# EAGLE design gripper board (EAGLE 7.4.0)
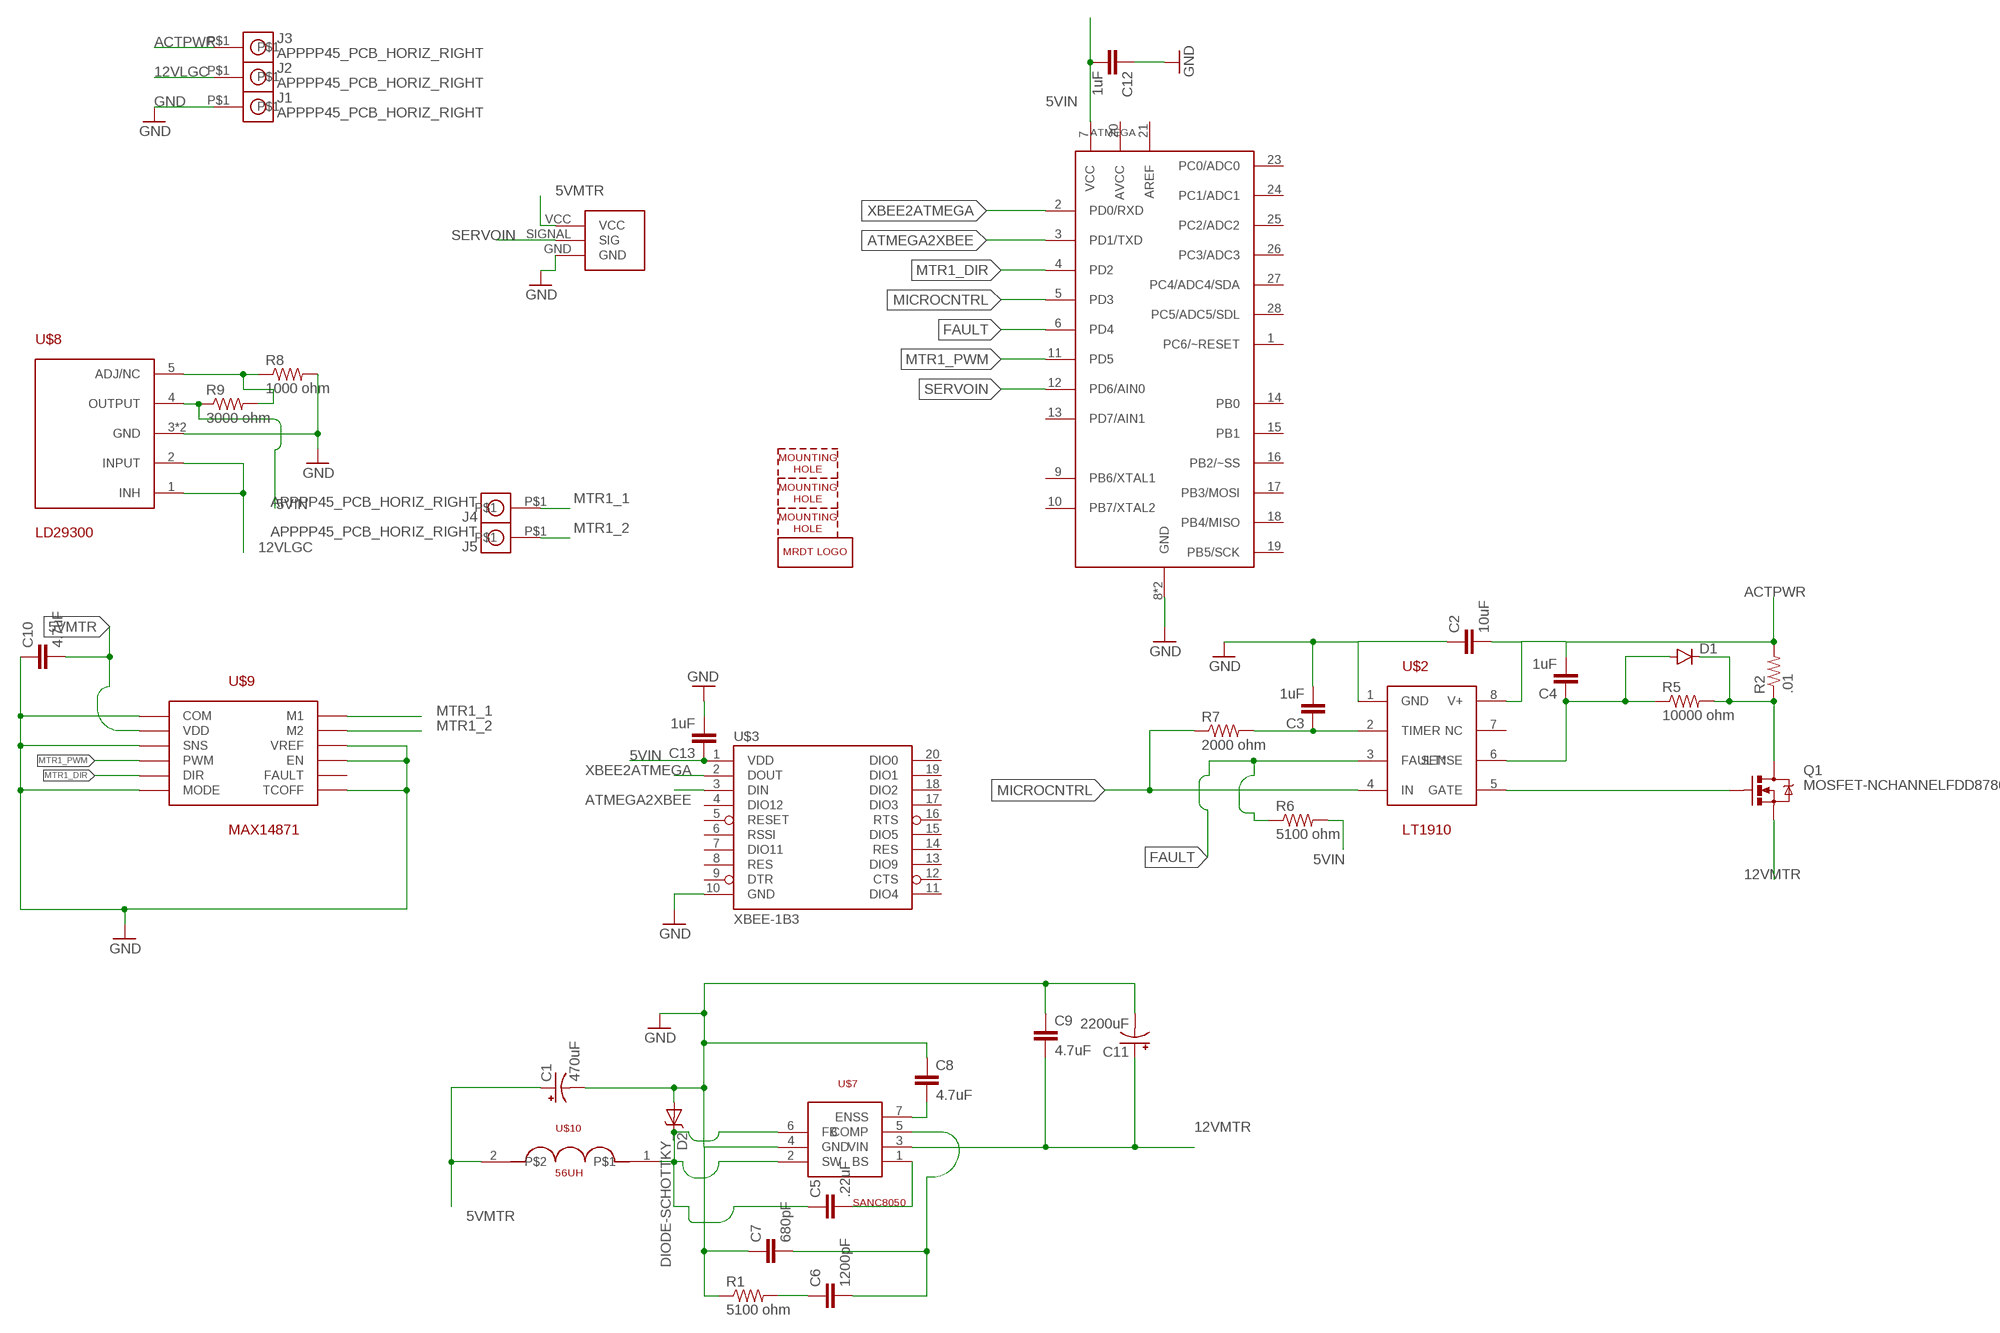
[diagram p0: schematic, sheet 1]

## Parts
ATMEGA  Q_ATMEGA328P  [DIP28]
C1  470uF  100UF-ELECT  [PANASONIC_H13]
C2  10uF  CAP0603-CAP  [0603-CAP]
C3  1uF  CAP0603-CAP  [0603-CAP]
C4  1uF  CAP0603-CAP  [0603-CAP]
C5  .22uF  1.0UF50V10%(1206)  [1206]
C6  1200pF  1.0UF50V10%(1206)  [1206]
C7  680pF  1.0UF50V10%(1206)  [1206]
C8  4.7uF  1.0UF50V10%(1206)  [1206]
C9  4.7uF  1.0UF50V10%(1206)  [1206]
C10  4.7uF  1.0UF50V10%(1206)  [1206]
C11  2200uF  C_108CKH050M  [C_16MM]
C12  1uF  CAP0603-CAP  [0603-CAP]
C13  1uF  CAP0603-CAP  [0603-CAP]
D1  DIODESMA  [SMA-DIODE]
D2  DIODE-SCHOTTKY_  [SMA-DIODE]
H1  MOUNTING_HOLE#4  [#4_SCREW]
H2  MOUNTING_HOLE#4  [#4_SCREW]
H3  MOUNTING_HOLE#4  [#4_SCREW]
J1  APPPP45_PCB_HORIZ_RIGHT  [APP45_PCB_HORIZ_RIGHT]
J2  APPPP45_PCB_HORIZ_RIGHT  [APP45_PCB_HORIZ_RIGHT]
J3  APPPP45_PCB_HORIZ_RIGHT  [APP45_PCB_HORIZ_RIGHT]
J4  APPPP45_PCB_HORIZ_RIGHT  [APP45_PCB_HORIZ_RIGHT]
J5  APPPP45_PCB_HORIZ_RIGHT  [APP45_PCB_HORIZ_RIGHT]
LOGO1  MRDT_LOGO  [MRDT_LOGO]
Q1  MOSFET-NCHANNELFDD8780  [DPAK]
R1  5100 ohm  RESISTOR0603-RES  [0603-RES]
R2  .01  RESISTORAXIAL-0.3  [AXIAL-0.3]
R5  10000 ohm  RESISTOR0603-RES  [0603-RES]
R6  5100 ohm  RESISTOR0603-RES  [0603-RES]
R7  2000 ohm  RESISTOR0603-RES  [0603-RES]
R8  1000 ohm  RESISTOR0603-RES  [0603-RES]
R9  3000 ohm  RESISTOR0603-RES  [0603-RES]
U$1  SERVO  [SERVO_JACK]
U$2  LT1910  [SOIC8]
U$3  XBEE-1B3  [XBEE-SMD]
U$7  SANC8050  [TO-220-7]
U$8  LD29300  [P2PAK]
U$9  MAX14871  [TSSOP-16]
U$10  56UH  [1210]

## Nets
5VIN: ATMEGA.7(VCC) C12.2 C13.1 R6.2 R9.1 U$3.1(VDD) U$8.4(OUTPUT)
5VMTR: C1.+ C10.2 U$1.VCC U$9.4(VDD) U$9.13(VDD) U$10.2
12VLGC: J2.P$1 U$8.1(INH) U$8.2(INPUT)
12VMTR: C9.2 C11.+ Q1.3(S) U$7.3(VIN)
ACTPWR: C2.2 C4.2 J3.P$1 R2.P$2 U$2.8(V+)
ATMEGA2XBEE: ATMEGA.3(PD1/TXD) U$3.3(DIN)
FAULT: ATMEGA.6(PD4) R6.1 U$2.3(FAULT*)
GND: ATMEGA.8(GND) ATMEGA.22(GND) C1.- C2.1 C3.2 C7.1 C8.1 C9.1 C10.1 C11.GND(-) C12.1 C13.2 D2.A J1.P$1 R1.1 R8.2 U$1.GND U$2.1(GND) U$3.10(GND) U$7.4(GND) U$8.3(GND) U$8.P$1(GND) U$9.1(COM) U$9.5(SNS) U$9.8(MODE) U$9.9(TCOFF) U$9.11(EN) U$9.12(VREF) U$9.16(COM)
MICROCNTRL: ATMEGA.5(PD3) R7.1 U$2.4(IN)
MTR1_1: J4.P$1 U$9.2(M1) U$9.3(M1)
MTR1_2: J5.P$1 U$9.14(M2) U$9.15(M2)
MTR1_DIR: ATMEGA.4(PD2) U$9.7(DIR)
MTR1_PWM: ATMEGA.11(PD5) U$9.6(PWM)
N$1: C3.1 R7.2 U$2.2(TIMER)
N$3: R8.1 R9.2 U$8.5(ADJ/NC)
N$5: C6.1 R1.2
N$6: C4.1 D1.A R5.1 U$2.6(SENSE)
N$7: Q1.1(G) U$2.5(GATE)
N$8: C8.2 U$7.7(ENSS)
N$9: D1.C Q1.4(D) R2.P$1 R5.2
N$10: C6.2 C7.2 U$7.5(COMP)
N$11: C5.1 D2.C U$7.2(SW) U$7.6(FB) U$10.1
N$12: C5.2 U$7.1(BS)
SERVOIN: ATMEGA.12(PD6/AIN0) U$1.SIGNAL(SIG)
XBEE2ATMEGA: ATMEGA.2(PD0/RXD) U$3.2(DOUT)
Unconnected: ATMEGA.1(PC6/~RESET) ATMEGA.9(PB6/XTAL1) ATMEGA.10(PB7/XTAL2) ATMEGA.13(PD7/AIN1) ATMEGA.14(PB0) ATMEGA.15(PB1) ATMEGA.16(PB2/~SS) ATMEGA.17(PB3/MOSI) ATMEGA.18(PB4/MISO) ATMEGA.19(PB5/SCK) ATMEGA.20(AVCC) ATMEGA.21(AREF) ATMEGA.23(PC0/ADC0) ATMEGA.24(PC1/ADC1) ATMEGA.25(PC2/ADC2) ATMEGA.26(PC3/ADC3) ATMEGA.27(PC4/ADC4/SDA) ATMEGA.28(PC5/ADC5/SDL) U$2.7(NC) U$3.4(DIO12) U$3.5(RESET) U$3.6(RSSI) U$3.7(DIO11) U$3.8(RES) U$3.9(DTR) U$3.11(DIO4) U$3.12(CTS) U$3.13(DIO9) U$3.14(RES) U$3.15(DIO5) U$3.16(RTS) U$3.17(DIO3) U$3.18(DIO2) U$3.19(DIO1) U$3.20(DIO0) U$9.10(FAULT)

## Library data of the parts
ATMEGA = MRDT-2014-All:Q_ATMEGA328P: ATMEGA 328P in 28PIN PDIP package
C1 = SparkFun-Capacitors:100UF-ELECT: 100uF electrolytic SMT CAP-08362- 63V 20%; PROD_ID: CAP-08362; VALUE: 100uF
C2-C4 C12 C13 = SparkFun-Capacitors:CAP: Capacitor Standard 0603 ceramic capacitor, and 0.1" leaded capacitor.
C5-C10 = MRDT-EAGLE-Training:1.0UF50V10%(1206): CAP-09822; PROD_ID: CAP-09822; VALUE: 1.0uF
C11 = MRDT-2014-All:C_108CKH050M: CAP ALUM 50V 0.1mF 1.1A ripple
D1 = MRDT-EAGLE-Training:DIODE: Diode These are standard reverse protection diodes and small signal diodes. SMA package can handle up to about 1A. SOD-323 can handle about 200mA. What the SOD-323 package when ordering, there are some mfgs out there that are 5-pin packages.
D2 = SparkFun-DiscreteSemi:DIODE-SCHOTTKY: Commonly MBRA140.
H1-H3 = MRDT-Hardware:MOUNTING_HOLE: Mounting hole for M6 bolt. Standard use mounting hole for: Tiva C Connected - M6 Anderson Powerpole Mounting Wing - M8 Most frame-mounted PCB's - M8
J1-J5 = MRDT-Connectors:APP: http://www.powerwerx.com/anderson-powerpoles/
LOGO1 = MRDT-Hardware:MRDT_LOGO
Q1 = SparkFun-DiscreteSemi:MOSFET-NCHANNEL: Common NMOSFET Parts MFG P/N Store ID Prod ID FDD8780 TRANS-09984 SI7820DN TRANS-11055 FDS6630A IC-08089 2N7002PW TRANS-11151 FQP30N06L COM-10213 TRANS-10060 BSS123LT1G TRANS-08345 BSS138 TRANS-00830 BS170 2N7000; PROD_ID: TRANS-09984
R1 R5-R9 = SparkFun-Passives:RESISTOR: Resistor Basic schematic elements and footprints for 0603, 1206, and PTH resistors.
R2 = SparkFun-Resistors:RESISTOR: Resistor Basic schematic elements and footprints for 0603, 1206, and PTH resistors.
U$1 = MRDT-2015-General:SERVO
U$2 = mylib1:LT1910: Transistor driver with internal current sensing
U$3 = SparkFun-RF:XBEE-1: Xbee module footprints SMT header is CONN-09042.; PROD_ID: CONN-09042
U$7 = opamps:SANC8050
U$8 = mylib1:LD29300
U$9 = tssopep:MAX14871: H bridge IC http://www.digikey.com/product-detail/en/maxim-integrated/MAX14871EUE-T/MAX14871EUE-CT-ND/5129512
U$10 = SparkFun-Capacitors:56UH

## Board
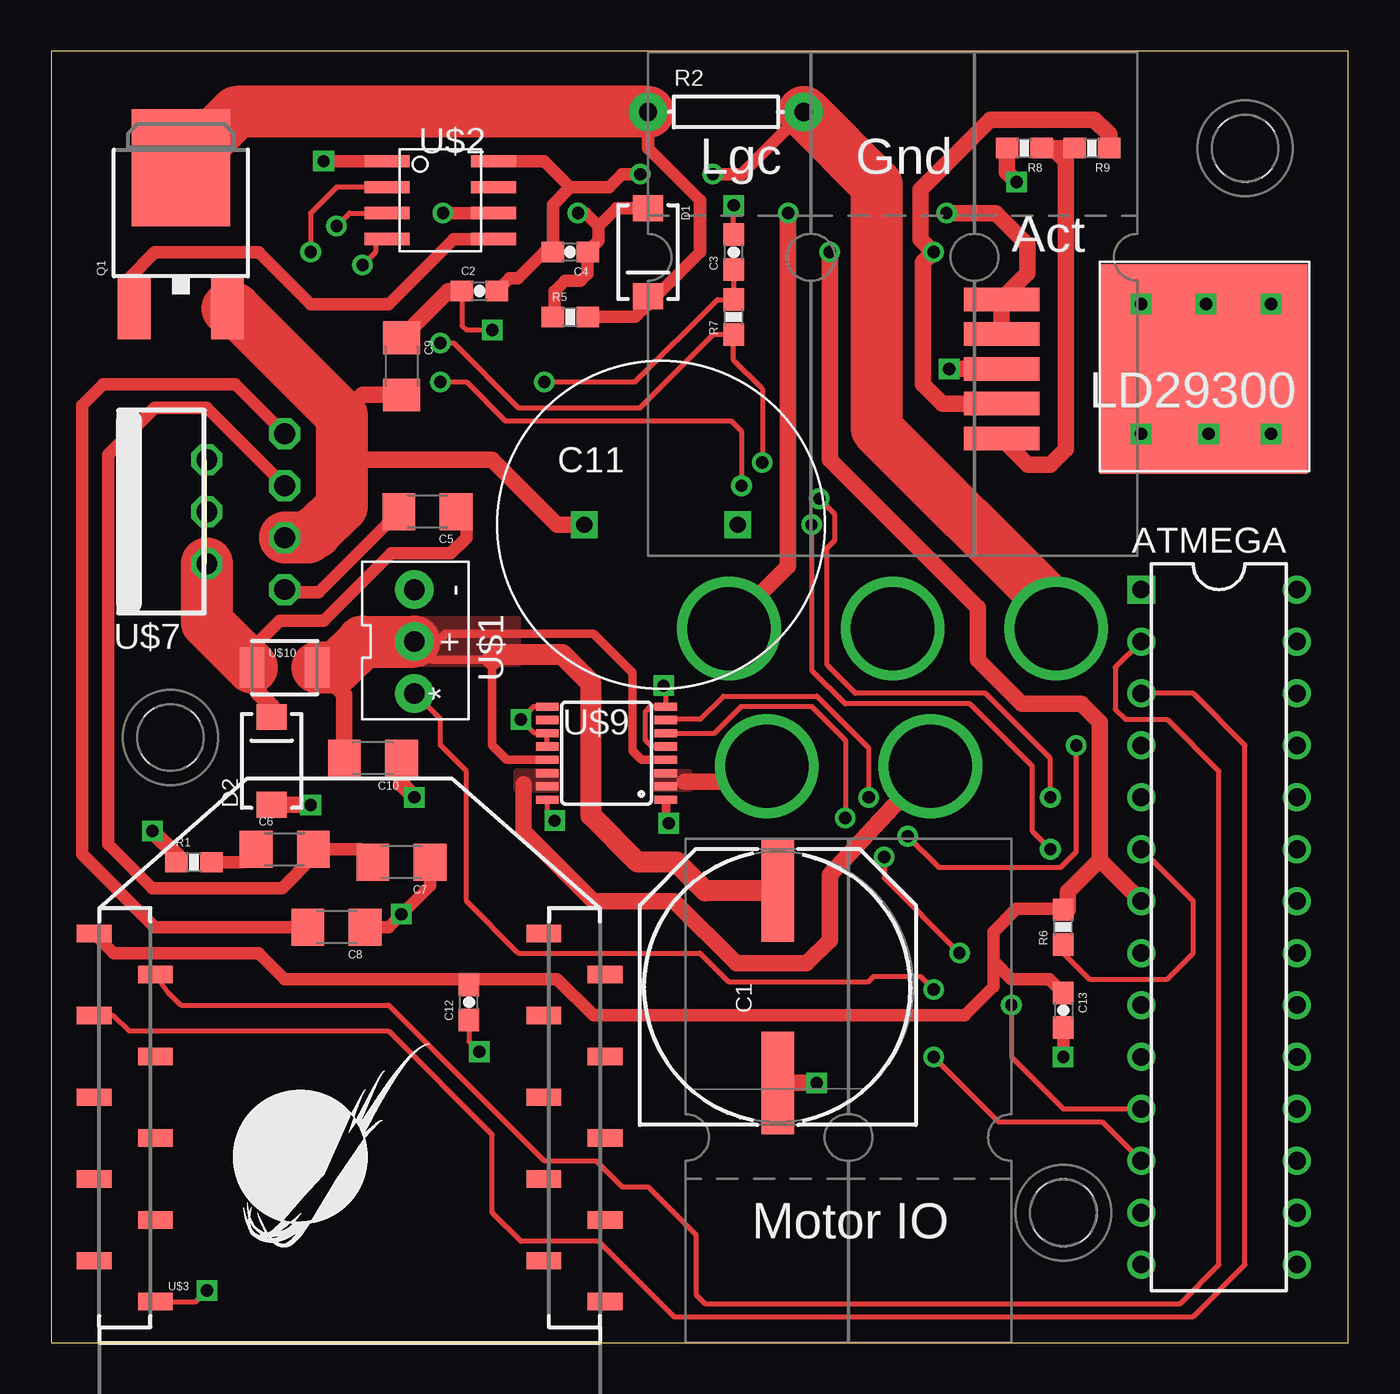
[diagram p1: board, top side]
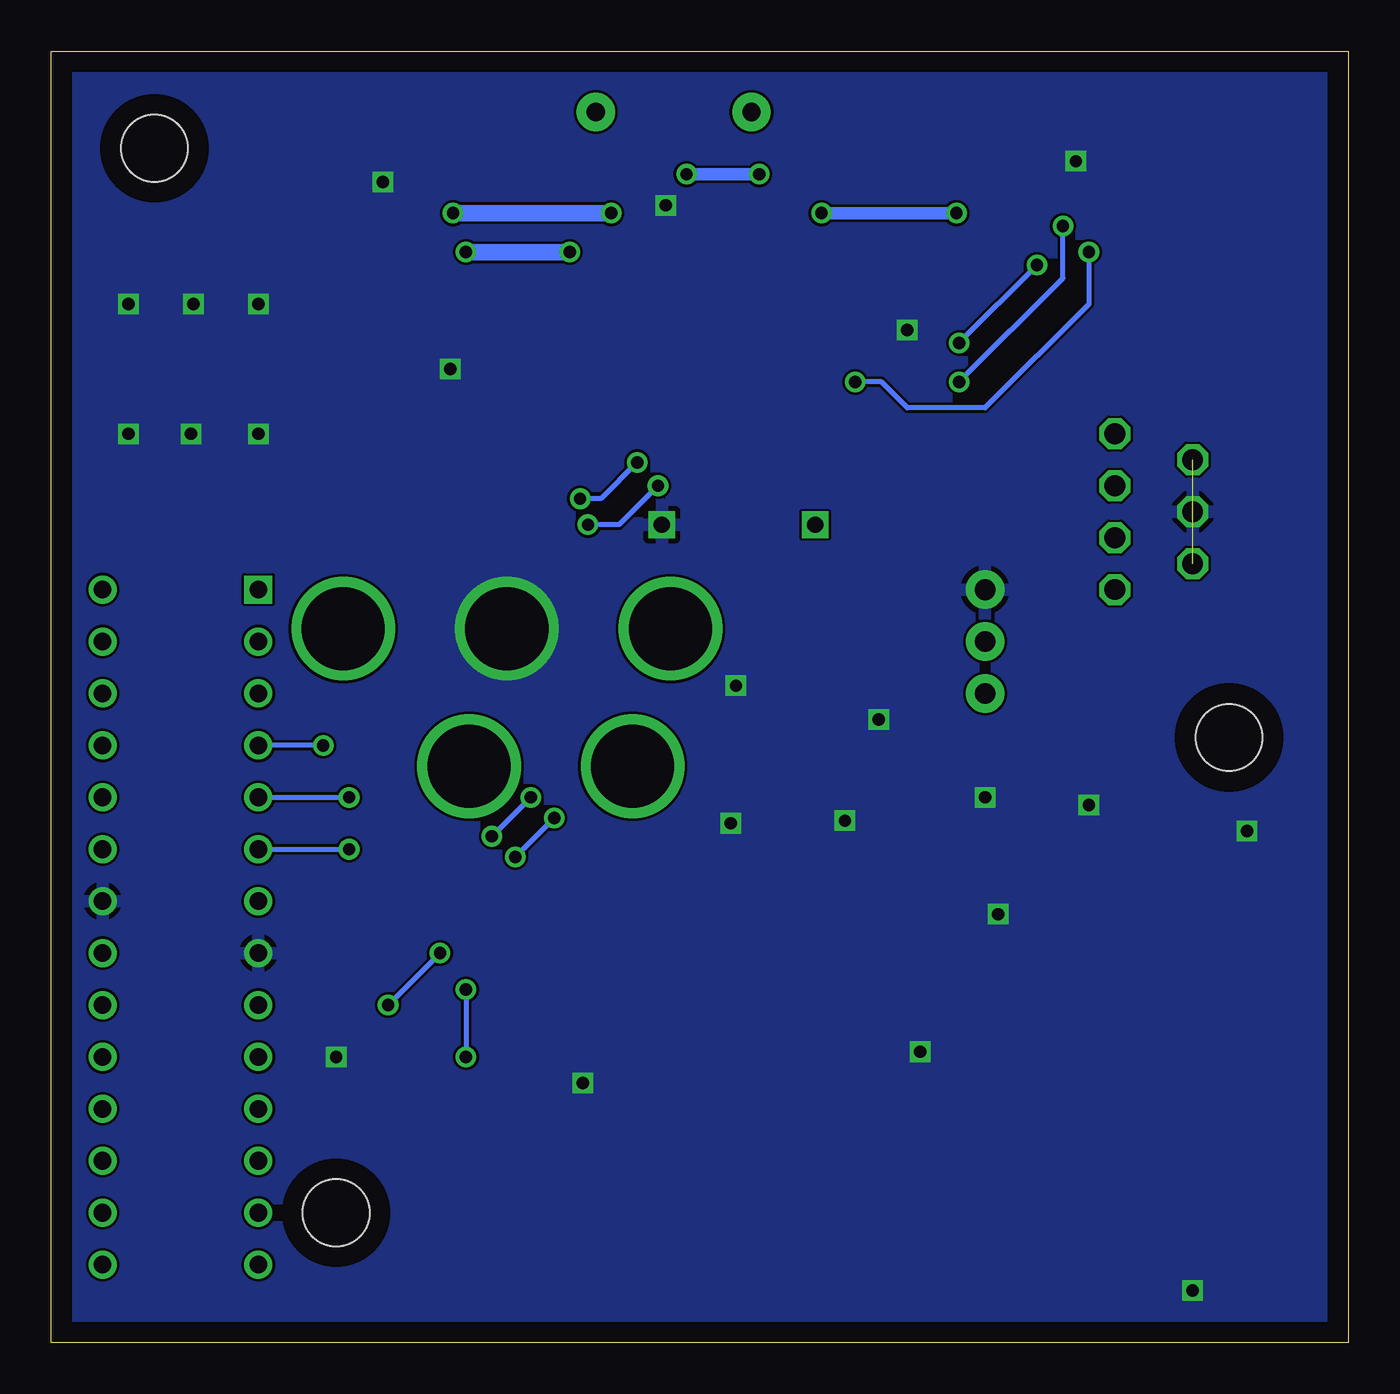
[diagram p2: board, bottom side, seen from below]

Size 63.48 x 63.17 mm. Coordinates in mm from the lower left corner, seen from the top.
Outline: 0,0 63.48,0 63.48,63.17 0,63.17 0,0
Copper layers (1*16): Top 0.035mm / dielectric 1.5mm / Bottom 0.035mm
Design rules "advanced_circuits_standard": minimum track width 5mil, minimum drill 10mil, track to track 5mil, track to pad 5mil, pad to pad 5mil, via to via 5mil, smd to smd 5mil, copper to edge 40mil, drill to drill 5mil, minimum pad ring 10mil, minimum via ring 8mil, stop-mask expansion 4mil, vias tented up to drill 0mil, thermal gap 10mil

### Footprints (pad centres in the part's own frame; a part is rotated, then mirrored left to right if it is on the bottom)
DIP28 = drill 0.864 square: 1 -16.51,-3.81 | drill 0.864: 2 -13.97,-3.81; 3 -11.43,-3.81; 4 -8.89,-3.81; 5 -6.35,-3.81; 6 -3.81,-3.81; 7 -1.27,-3.81; 8 1.27,-3.81; 9 3.81,-3.81; 10 6.35,-3.81; 11 8.89,-3.81; 12 11.43,-3.81; 13 13.97,-3.81; 14 16.51,-3.81; 15 16.51,3.81; 16 13.97,3.81; 17 11.43,3.81; 18 8.89,3.81; 19 6.35,3.81; 20 3.81,3.81; 21 1.27,3.81; 22 -1.27,3.81; 23 -3.81,3.81; 24 -6.35,3.81; 25 -8.89,3.81; 26 -11.43,3.81; 27 -13.97,3.81; 28 -16.51,3.81
PANASONIC_H13 = smd 5 x 1.6: + 4.7,0; - -4.7,0
0603-CAP = smd 1.1 x 1: 1 -0.85,0; 2 0.85,0
1206 = smd 1.6 x 1.8: 1 -1.4,0; 2 1.4,0
C_16MM = drill 0.8 square: + 0,3.75; GND 0,-3.75
SMA-DIODE = smd 1.27 x 1.47: A -2.15,0; C 2.15,0
#4_SCREW = hole 3.264: 0,0
APP45_PCB_HORIZ_RIGHT = drill 4.064: P$1 28.194,3.969
DPAK = smd 1.6 x 3: 1 -2.28,-5.31; 3 2.28,-5.31 | smd 4.826 x 5.715: 4 0,1.588
0603-RES = smd 1.1 x 1: 1 -0.85,0; 2 0.85,0
AXIAL-0.3 = drill 0.9 pad 1.88: P$1 -3.81,0; P$2 3.81,0
SERVO_JACK = drill 1.016 pad 1.88: GND -2.539,0; SIGNAL 2.541,0; VCC 0.001,0
SOIC8 = smd 2.2 x 0.6: 1 -2.6,1.905; 2 -2.6,0.635; 3 -2.6,-0.635; 4 -2.6,-1.905; 5 2.6,-1.905; 6 2.6,-0.635; 7 2.6,0.635; 8 2.6,1.905
XBEE-SMD = smd 1.7 x 0.85: 1 -12.5,20; 2 -9.5,18; 3 -12.5,16; 4 -9.5,14; 5 -12.5,12; 6 -9.5,10; 7 -12.5,8; 8 -9.5,6; 9 -12.5,4; 10 -9.5,2; 11 12.5,2; 12 9.5,4; 13 12.5,6; 14 9.5,8; 15 12.5,10; 16 9.5,12; 17 12.5,14; 18 9.5,16; 19 12.5,18; 20 9.5,20
TO-220-7 = drill 1.016 octagon: 1 -3.81,3.81; 2 0,2.54; 3 -3.81,1.27; 4 0,0; 5 -3.81,-1.27; 6 0,-2.54; 7 -3.81,-3.81
P2PAK = smd 1.15 x 3.7: 1 -3.4,-4.8; 2 -1.7,-4.8; 3 0,-4.8; 4 1.7,-4.8; 5 3.4,-4.8 | smd 10.25 x 10.16: P$1 0,5.08
TSSOP-16 = smd 0.4 x 1.1: 1 -2.275,-2.9; 2 -1.625,-2.9; 3 -0.975,-2.9; 4 -0.325,-2.9; 5 0.325,-2.9; 6 0.975,-2.9; 7 1.625,-2.9; 8 2.275,-2.9; 9 2.275,2.9; 10 1.625,2.9; 11 0.975,2.9; 12 0.325,2.9; 13 -0.325,2.9; 14 -0.975,2.9; 15 -1.625,2.9; 16 -2.275,2.9
1210 = smd 1.2 x 2: 1 -1.6,0; 2 1.6,0

### Placement (x,y rotation side)
ATMEGA  57.15,20.32 270 top
C1  35.56,17.4 90 top
C2  20.95,51.44 0 top
C3  33.4,53.34 90 top
C4  25.4,53.34 180 top
C5  18.41,40.64 180 top
C6  11.43,24.13 0 top
C7  17.14,23.5 180 top
C8  13.97,20.32 180 top
C9  17.14,47.75 270 top
C10  15.75,28.57 180 top
C11  29.84,40.01 90 top
C12  20.45,16.64 90 top
C13  49.53,16.26 270 top
D1  29.21,53.34 270 top
D2  10.79,28.45 90 top
H1  49.53,6.35 0 top
H2  58.42,58.42 0 top
H3  5.84,29.59 0 top
J1  37.21,63.12 270 top
J2  29.21,63.12 270 top
J3  45.21,63.12 270 top
J4  38.99,0 90 top
J5  46.99,0 90 top
LOGO1  8.89,3.81 0 top
Q1  6.35,55.88 0 top
R1  6.99,23.5 0 top
R2  33.02,60.2 0 top
R5  25.4,50.16 0 top
R6  49.53,20.32 90 top
R7  33.4,50.16 90 top
R8  47.62,58.42 180 top
R9  50.93,58.42 180 top
U$1  17.78,34.29 270 top
U$2  19.05,55.88 0 top
U$3  14.61,0 0 top
U$7  7.62,40.64 180 top
U$8  51.31,47.62 270 top
U$9  27.18,28.83 90 top
U$10  11.43,33.02 0 top

### Tracks (layer width: path | path; a pad name or v marks a point on that pad's centre or on a via)
5VIN  (via drill 0.6)
  Top 0.254: C12.2 20.45,17.65 20.32,17.78
  Top 0.61: 49.74,21.17 R6.2 49.49,21.21 47.24,21.21 46.1,20.07 46.1,18.67 | U$3.1 3.06,19.05 10.16,19.05 11.43,17.78 20.32,17.78 24.77,17.78 26.54,16 44.7,16 46.1,17.4 46.1,18.67 | 46.1,18.67 46.99,17.78 48.86,17.78 C13.1
  Top 0.813: v38.1,53.34 38.1,43.18 45.34,35.94 45.34,33.4 47.5,31.24 50.42,31.24 51.31,30.35 51.31,23.62 | 51.31,23.62 ATMEGA.7 | 49.74,21.17 49.74,22.06 51.31,23.62 | R9.1 51.78,59.09 51.05,59.82 45.97,59.82 42.55,56.39 42.55,53.98 v43.18,53.34 42.67,52.83 42.67,46.86 43.61,45.92 U$8.4
  Bottom 0.813: v43.18,53.34 v38.1,53.34
5VMTR
  Top 0.406: U$1.VCC | U$1.VCC 18.92,34.29 19.3,34.67 26.54,34.67 28.45,32.77 28.45,28.96 28.9,28.5 U$9.4 | U$1.VCC 18.67,33.4 21.59,33.4 21.59,29.21 22.3,28.5 U$9.13
  Top 0.813: C10.2 14.35,31.7 U$10.2
  Top 1.016: C1.+ 32,22.1 30.61,23.5 28.7,23.5 26.42,25.78 26.42,32.26 25.02,33.66 21.84,33.66 21.59,33.4
  Top 2.54: U$10.2 13.97,33.02 15.24,34.29 U$1.VCC
  pour Top (no thermals): 16.51,35.43 22.86,35.43 22.86,33.15 16.51,33.15
12VLGC  (via drill 0.6)
  Top 0.813: v36.07,55.24 36.07,37.97 33.18,35.08 J2.P$1 | U$8.2 U$8.1 47.78,52.3 47.78,53.7 46.23,55.24 v43.81,55.24
  Bottom 0.813: v36.07,55.24 v43.81,55.24
12VMTR
  Top 0.813: 14.22,43.18 21.59,43.18 24.77,40.01 C11.+ | C9.2 15.24,46.35 14.22,45.34
  Top 2.54: U$7.3 12.57,39.37 12.83,39.62 12.95,39.62 14.22,40.89 14.22,43.18 14.22,45.34 8.99,50.57 Q1.3
ACTPWR  (via drill 0.6)
  Top 0.61: U$2.8 24.13,57.78 25.4,56.52 | 25.4,56.52 24.55,55.66 C4.2 24.13,53.34 22.86,52.07 22.44,52.07 C2.2 | R2.P$2 33.78,57.15 v32.38,57.15 | 25.4,56.52 27.3,56.52 27.94,57.15 v28.83,57.15
  Top 2.54: R2.P$2 40.39,56.64 40.39,44.7 49.18,35.91 J3.P$1
  Bottom 0.61: v32.38,57.15 v28.83,57.15
ATMEGA2XBEE
  Top 0.254: U$3.3 3.05,16 3.81,15.24 16.51,15.24 21.59,10.16 21.59,6.35 22.99,4.95 26.8,4.95 30.48,1.27 55.88,1.27 58.42,3.81 58.42,29.21 55.88,31.75 ATMEGA.3
FAULT  (via drill 0.6)
  Top 0.254: v13.97,54.61 14.61,55.24 U$2.3 | R6.1 49.53,19.05 50.8,17.78 54.61,17.78 55.88,19.05 55.88,21.59 ATMEGA.6 | v19.05,46.99 20.32,46.99 22.23,45.09 33.27,45.09 33.78,44.58 v33.78,41.91 | v48.9,24.13 48.01,25.02 48.01,28.19 44.96,31.24 38.86,31.24 37.21,32.89 v37.21,40.01
  Bottom 0.254: ATMEGA.6 v48.9,24.13 | v19.05,46.99 13.97,52.07 v13.97,54.61 | v33.78,41.91 35.69,40.01 v37.21,40.01
GND  (via drill 0.6)
  Top 0.254: R1.1 5.71,23.5 | C2.1 20.11,49.74 20.32,49.53 v21.59,49.53 | U$3.10 7.08,2 v7.62,2.54 | U$9.12 U$9.11 23.66,29.8 v22.99,30.48 23.61,31.1 U$9.9 | U$9.5 29.39,29.15 29.08,29.46 29.08,30.86 29.34,31.11 30.07,31.11 U$9.8 30.08,32.02 v29.97,32.13 | U$9.16 24.28,25.89 v24.64,25.53 | C3.2 v33.4,55.63 | C12.1 20.45,14.73 v20.95,14.22
  Top 0.406: U$9.1 30.08,25.55 v30.23,25.4
  Top 0.61: U$2.1 v13.34,57.78 | C8.1 16.51,20.32 v17.14,20.95 18.55,22.36 C7.1 | C13.2 v49.53,13.97
  Top 0.813: C10.1 17.15,27.3 v17.78,26.67 | v37.47,12.7 C1.- | C9.1 19.43,51.44 C2.1 | R8.2 46.77,57.24 v47.24,56.77 | D2.A 12.56,26.3 12.57,26.29 v12.7,26.29 | R1.1 6.13,23.84 v4.95,25.02 | U$8.3 v43.94,47.62 | v59.69,50.8 57.15,50.8 57.15,48.39 U$8.P$1 55.88,48.13 | v56.64,44.45 56.64,46.23 55.88,46.99 55.88,48.13 | 55.88,48.26 55.88,48.13
  other vias: 53.34,44.45 59.69,44.45 53.34,50.8 56.52,50.8
  pour Bottom: -1.27,63.5 -1.27,-2.54 64.77,-2.54 64.77,64.77 -1.27,64.77
MICROCNTRL  (via drill 0.6)
  Top 0.254: U$2.4 15.88,53.98 15.88,53.34 v15.24,52.7 | v19.05,48.9 19.68,48.9 22.86,45.72 28.83,45.72 32.42,49.31 R7.1 33.4,48.05 34.8,46.65 v34.8,43.05 | v48.9,26.67 48.9,28.57 45.72,31.75 39.37,31.75 37.97,33.15 37.97,38.86 38.35,39.24 38.35,40.51 v37.59,41.27
  Bottom 0.254: ATMEGA.5 v48.9,26.67 | v15.24,52.7 v19.05,48.9 | v34.8,43.05 36.58,41.27 v37.59,41.27
MTR1_1
  Top 0.813: J4.P$1 34.64,27.43 30.99,27.43
  pour Top (no thermals): 29.46,27.94 31.24,27.94 31.24,27.05 29.46,27.05
MTR1_2
  Top 0.813: J5.P$1 38.1,22.89 38.1,19.68 36.96,18.54 33.53,18.54 30.48,21.59 26.54,21.59 23.11,25.02 23.11,27.3
  pour Top (no thermals): 24.77,27.94 22.73,27.94 22.73,27.05 24.77,27.05
MTR1_DIR  (via drill 0.6)
  Top 0.254: U$9.7 30.1,30.48 31.75,30.48 32.89,31.62 37.47,31.62 40.01,29.08 v40.01,26.67 | v41.91,24.77 43.43,23.24 49.4,23.24 50.16,24 v50.16,29.21
  Bottom 0.254: v40.01,26.67 v41.91,24.77 | v50.16,29.21 ATMEGA.4
MTR1_PWM  (via drill 0.6)
  Top 0.254: U$9.6 32.47,29.8 33.78,31.11 37.21,31.11 38.86,29.46 v38.86,25.65 | 53.09,11.43 ATMEGA.11 49.53,11.43 46.99,13.97 v46.99,16.51 | v40.77,23.75 40.77,22.73 v44.45,19.05
  Bottom 0.254: v38.86,25.65 v40.77,23.75 | v44.45,19.05 v46.99,16.51
N$1  (via drill 0.6)
  Top 0.254: C3.1 R7.2 32.6,51.02 28.57,46.99 v24.13,46.99 | U$2.2 13.97,56.52 12.7,55.24 v12.7,53.34
  Bottom 0.254: v12.7,53.34 12.7,50.8 17.78,45.72 21.59,45.72 22.86,46.99 v24.13,46.99
N$3
  Top 0.813: R9.2 49.02,58.42 | 49.02,58.42 R8.1 | U$8.5 47.81,42.93 48.9,42.93 49.66,43.69 49.66,57.78 49.02,58.42
N$5
  Top 0.254: 9.39,23.5 C6.1
  Top 0.61: R1.2 9.39,23.5
N$6  (via drill 0.6)
  Top 0.61: U$2.6 v19.18,55.24 | 26.8,54.61 26.8,53.89 C4.1 26.25,52.28 25.91,51.94 25.15,51.94 24.64,51.44 24.64,50.25 R5.1 | v25.78,55.24 26.16,55.24 26.8,54.61 | D1.A 27.68,55.49 26.8,54.61
  Bottom 0.61: v19.18,55.24 v25.78,55.24
N$7
  Top 0.406: Q1.1 4.07,51.06
  Top 0.61: U$2.5 19.68,53.98 16.51,50.8 12.7,50.8 10.16,53.34 5.08,53.34 3.81,52.07 3.81,50.83 Q1.1
N$8
  Top 0.61: C8.2 5.08,20.32 1.52,23.88 1.52,45.85 2.54,46.86 9.02,46.86 U$7.7
N$9
  Top 0.254: D1.C 29.21,50.8
  Top 0.61: R2.P$1 29.21,58.42 31.75,55.88 31.75,53.34 29.6,51.19 D1.C | 29.21,50.8 28.57,50.16 R5.2
  Top 2.54: R2.P$1 9.08,60.2 Q1.4
N$10
  Top 0.61: C7.2 15.11,24.13 C6.2 12.83,23.75 11.3,22.23 4.95,22.23 2.79,24.38 2.79,43.43 5.08,45.72 7.62,45.72 U$7.5
N$11  (1 unrouted)
  Top 0.61: 9.77,33.08 9.36,33.49 11.18,35.31 13.34,35.31 16.64,38.61 19.56,38.61 20.32,39.37 20.32,40.51 C5.1
  Top 0.813: D2.C 10.79,31.11 10.16,31.75 10.16,32.69 U$10.1
  Top 2.54: U$7.2 7.62,35.23 9.36,33.49 U$10.1
N$12
  Top 0.61: C5.2 13.08,36.7 11.56,36.7 U$7.1
SERVOIN  (via drill 0.6)
  Top 0.254: v43.18,13.97 46.35,10.79 51.44,10.79 ATMEGA.12 | U$1.SIGNAL 19.05,30.48 19.05,29.21 20.32,27.94 20.32,21.59 22.86,19.05 31.75,19.05 33.15,17.65 40.01,17.65 40.26,17.91 42.55,17.91 v43.18,17.27
  Bottom 0.254: v43.18,17.27 v43.18,13.97
XBEE2ATMEGA
  Top 0.254: U$3.2 5.74,17.12 6.35,16.51 16.51,16.51 24.13,8.89 26.67,8.89 27.94,7.62 29.21,7.62 31.56,5.27 31.56,2.35 32,1.91 55.24,1.91 57.15,3.81 57.15,27.94 54.61,30.48 52.58,30.48 52.07,30.99 52.07,33.02 ATMEGA.2

### Text on the board
tNames: Lgc | Gnd | Act | LD29300 | Motor IO